# EAGLE design SdAdapter (EAGLE 6.5.0)
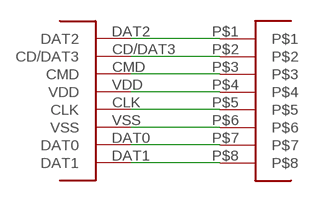
[diagram p0: schematic, sheet 1]

## Parts
U$1  MICROSD_PADSMICROSD  [MICROSD_PADS]
U$2  M08  [1X08_1MM_SMT]

## Nets
N$1: U$1.DAT2 U$2.P$1
N$2: U$1.CD/DAT3 U$2.P$2
N$3: U$1.CMD U$2.P$3
N$4: U$1.VDD U$2.P$4
N$5: U$1.CLK U$2.P$5
N$6: U$1.VSS U$2.P$6
N$7: U$1.DAT0 U$2.P$7
N$8: U$1.DAT1 U$2.P$8

## Library data of the parts
U$1 = blinkinlabs:MICROSD_PADS
U$2 = blinkinlabs:M08

## Board
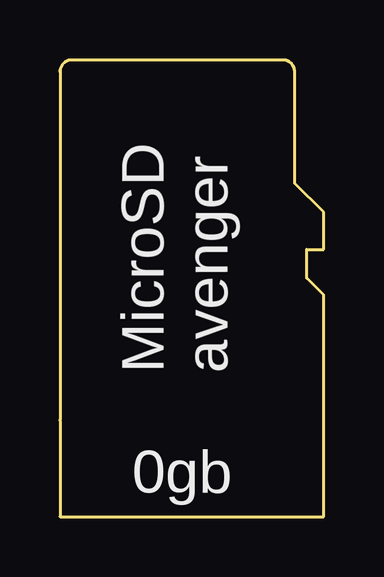
[diagram p1: board, top side]
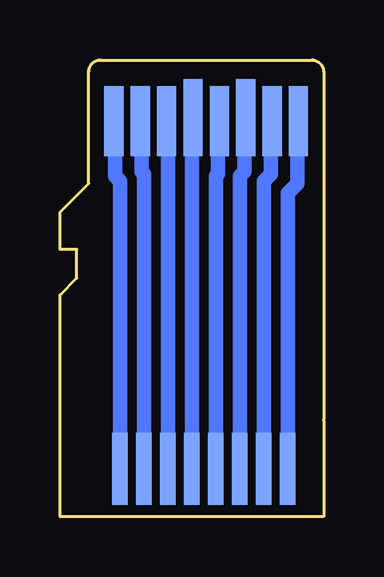
[diagram p2: board, bottom side, seen from below]

Size 11 x 19.05 mm. Coordinates in mm from the lower left corner, seen from the top.
Outline: 0,4 0,0 11,0 11,4
Copper layers (1*16): Top 0.035mm / dielectric 1.5mm / Bottom 0.035mm
Design rules "default": minimum track width 10mil, minimum drill 24mil, track to track 8mil, track to pad 8mil, pad to pad 8mil, via to via 8mil, smd to smd 8mil, copper to edge 40mil, drill to drill 8mil, minimum pad ring 10mil, minimum via ring 8mil, stop-mask expansion 4mil, vias tented up to drill 0mil, thermal gap 10mil

### Footprints (pad centres in the part's own frame; a part is rotated, then mirrored left to right if it is on the bottom)
MICROSD_PADS = smd 0.8 x 2.9 bottom: CD/DAT3 2.75,0; CLK -0.55,0; CMD 1.65,0; DAT0 -2.75,0; DAT1 -3.85,0; DAT2 3.85,0 | smd 0.8 x 3.2 bottom: VDD 0.55,0.15; VSS -1.65,0.15
1X08_1MM_SMT = smd 3 x 0.635: P$1 0,0; P$2 0,-1; P$3 0,-2; P$4 0,-3; P$5 0,-4; P$6 0,-5; P$7 0,-6; P$8 0,-7

### Placement (x,y rotation side)
U$1  4.9,16.5 0 top
U$2  8.5,2 90 bottom

### Tracks (layer width: path | path; a pad name or v marks a point on that pad's centre or on a via)
N$1
  Bottom 0.61: U$2.P$1 8.5,14 8.7,14.2 8.7,16.45 U$1.DAT2
N$2
  Bottom 0.61: U$2.P$2 7.5,14.3 7.6,14.4 7.6,16.45 U$1.CD/DAT3
N$3
  Bottom 0.61: U$2.P$3 6.5,16.45 U$1.CMD
N$4
  Bottom 0.61: U$2.P$4 5.5,16.6 U$1.VDD
N$5
  Bottom 0.61: U$2.P$5 4.5,14.2 4.4,14.3 4.4,16.45 U$1.CLK
N$6
  Bottom 0.61: U$2.P$6 3.5,14.2 3.3,14.4 3.3,16.6 U$1.VSS
N$7
  Bottom 0.61: U$2.P$7 2.5,14 2.2,14.3 2.2,16.45 U$1.DAT0
N$8
  Bottom 0.61: U$2.P$8 1.5,13.5 1.1,13.9 1.1,16.45 U$1.DAT1

### Text on the board
tNames: MicroSD / avenger | 0gb